# EasyEDA Pro project ProDocument_PCB_2024-08-10_Lastest.epro

# Board PCB1
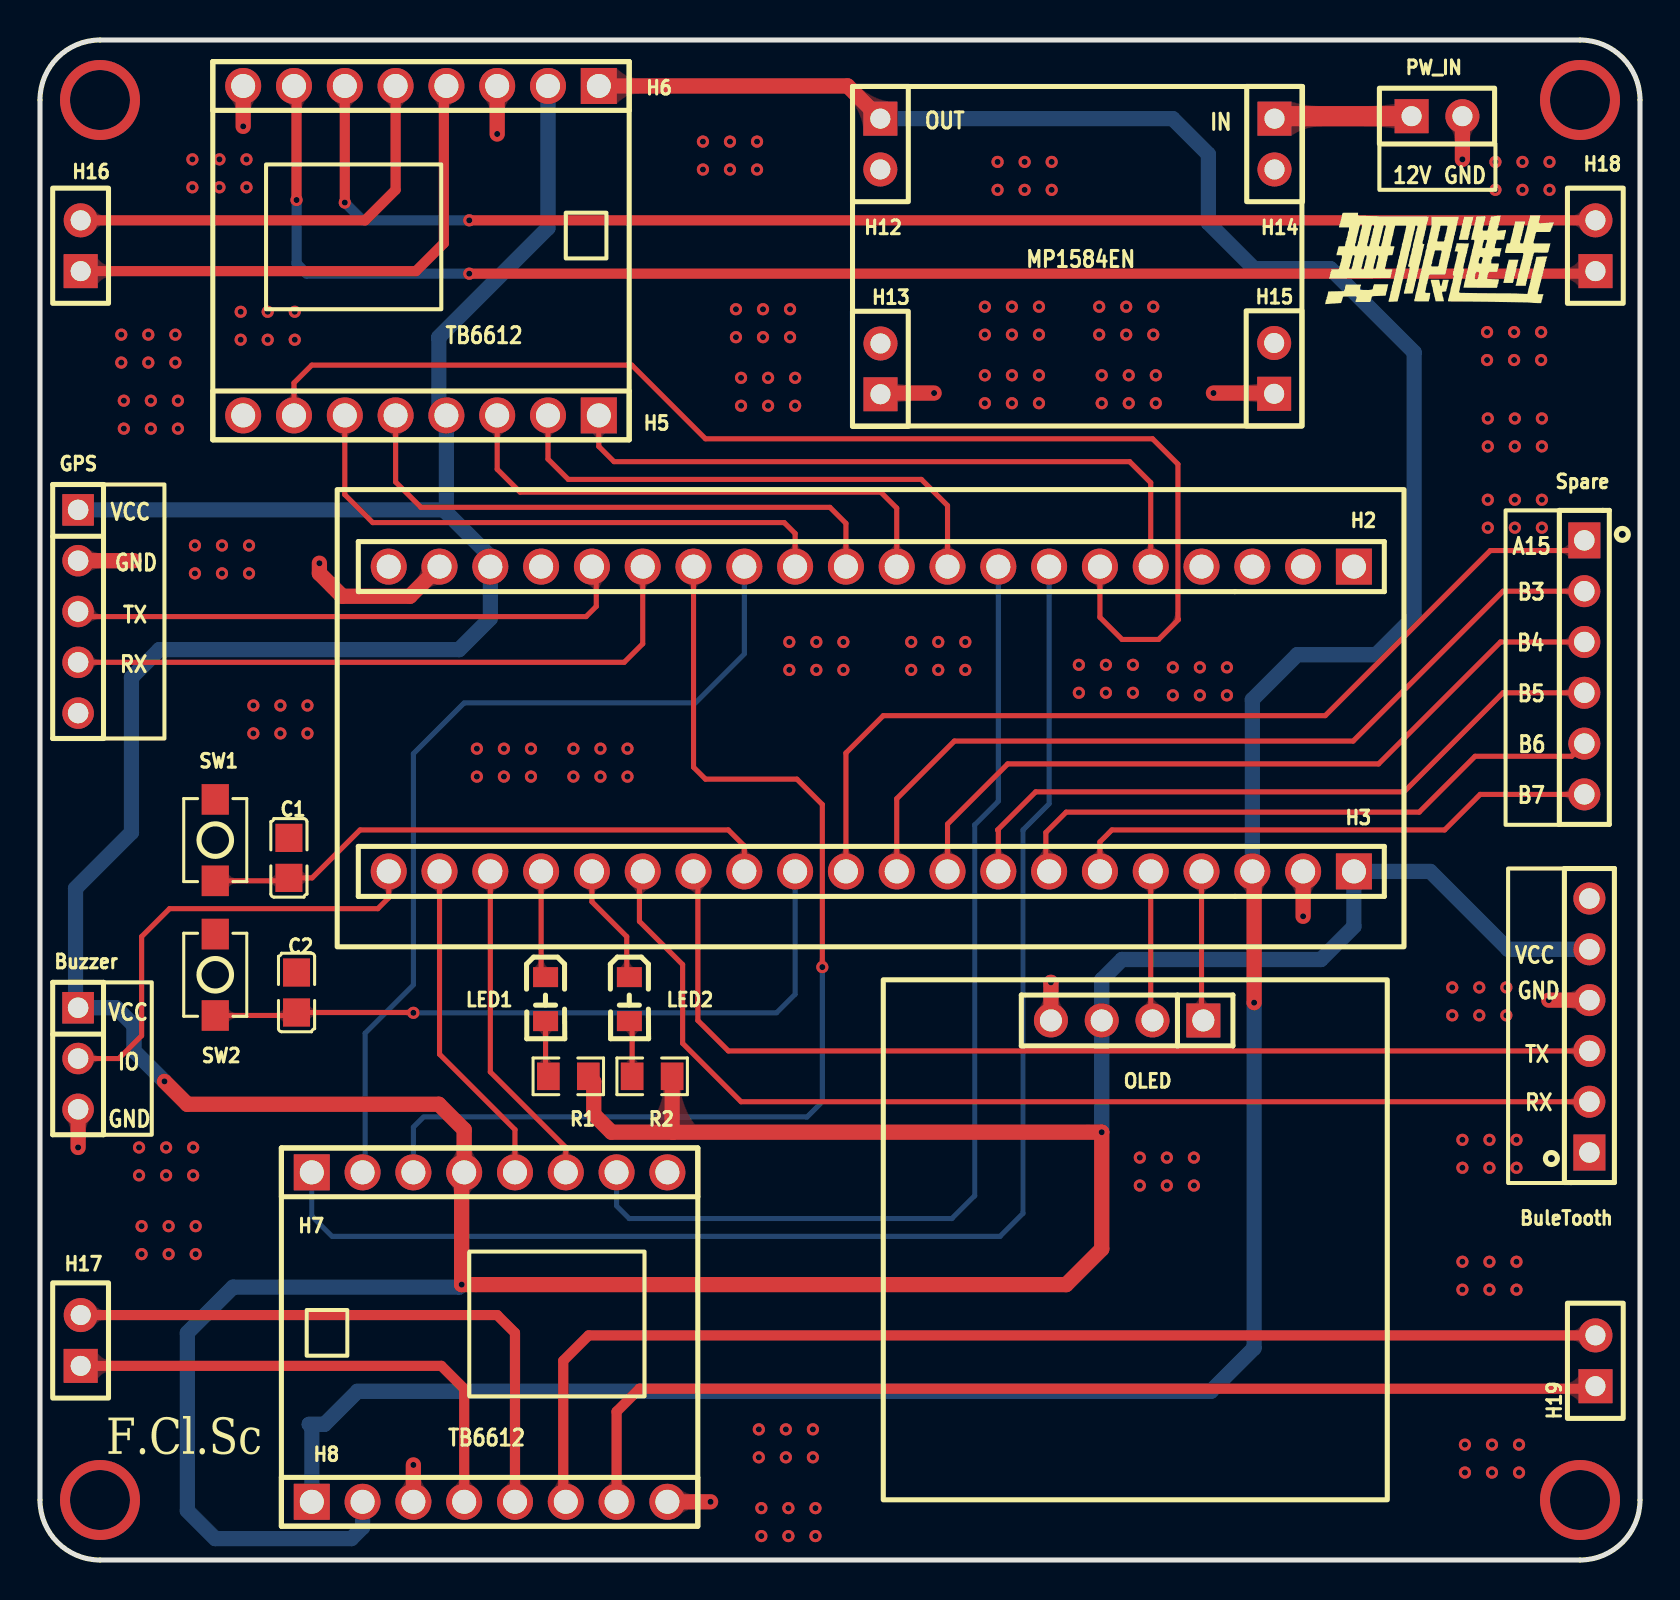
[diagram p0: board, top side]
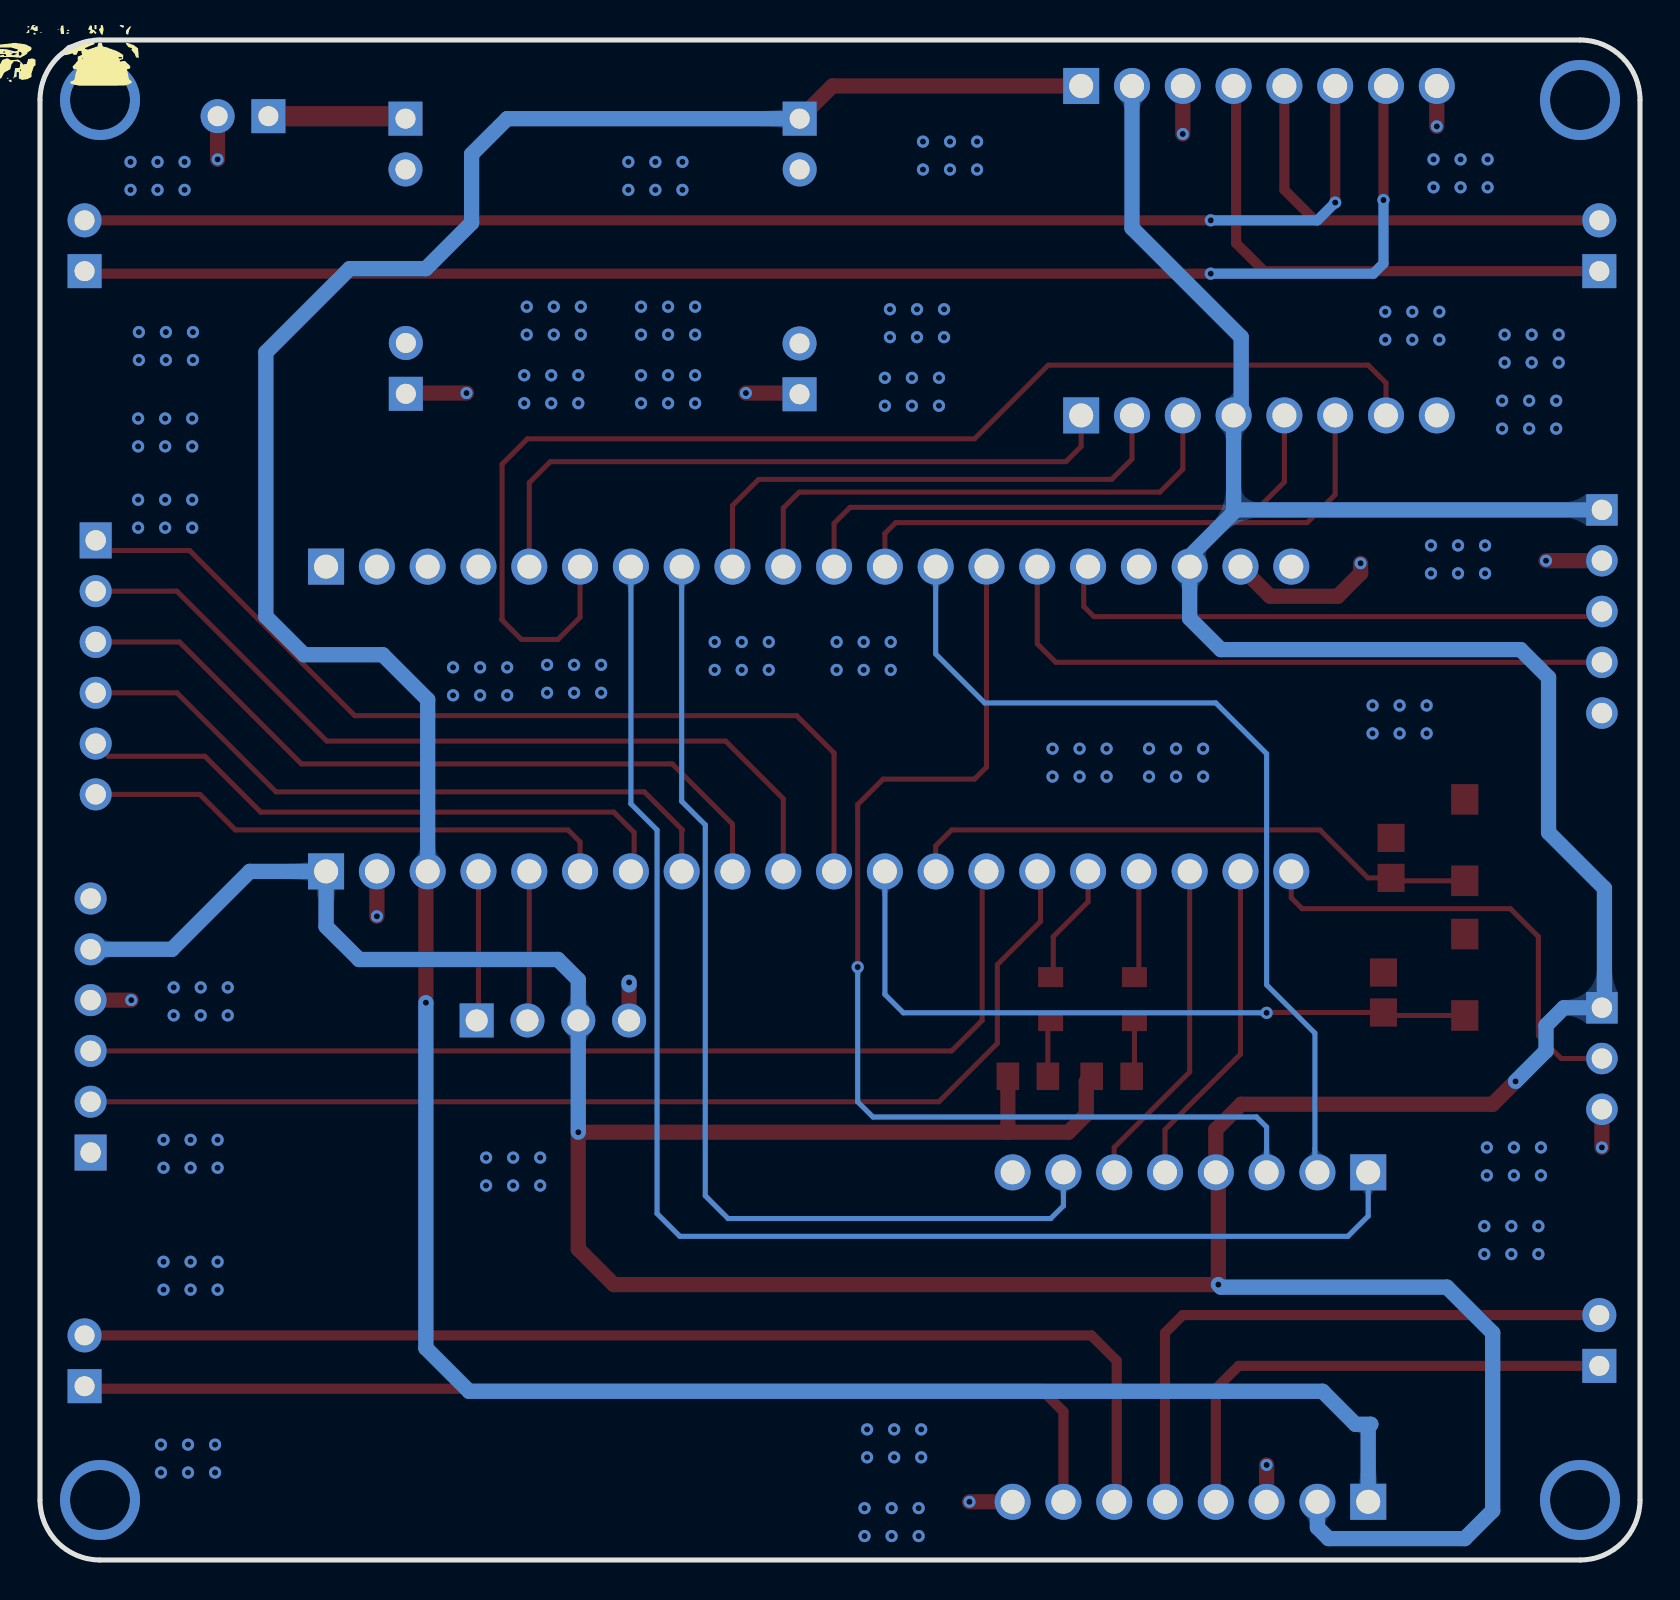
[diagram p1: board, bottom side, seen from below]

Outline 80 x 76 mm; copper layers: Top Layer, Bottom Layer. Coordinates in mm from the lower left corner of the outline.
Outline path: 0,73 0,3 arc(0.88,0.88) 3,0 77,0 arc(79.12,0.88) 80,3 80,73 arc(79.12,75.12) 77,76 3,76 arc(0.88,75.12) 0,73
Stack: Top Layer 0.035mm / Dielectric1 1.51mm FR4 er 4.5 / Bottom Layer 0.035mm

## Design rules (mm)
template: JLCPCB Capability(Two Layers Board)
spacing copperThickness1oz (default): track to track 0.102, other pairs 0.152 to 0.3
spacing copperThickness2oz: track to track 0.203, other pairs 0.152 to 0.3
track width copperThickness1oz (default): min 0.127, default 0.254, max 2.54
track width copperThickness2oz: min 0.203, default 0.254, max 2.54
differential pair differentialPair (default): width min 0.127, default 0.254, max 2.54; gap min 0.152, default 0.152
via viaSize (default): diameter min 0.5, default 0.61, max 10; hole min 0.3, default 0.305, max 6.3

## Placement (name value [footprint] x y rotation side)
BuleTooth  -  [HDR-TH_6P-P2.54-V-F]  77.47 26.72 90 top
Buzzer  -  [HDR-TH_3P-P2.54-V-F]  1.91 25.07 270 top
C1  10uF  [C0805]  12.45 35.11 90 top
C2  10uF  [C0805]  12.83 28.38 90 top
GPS  -  [HDR-TH_5P-P2.54-V-F]  1.91 47.42 270 top
H2  -  [HDR-TH_20P-P2.54-V-F]  41.57 49.67 180 top
H3  -  [HDR-TH_20P-P2.54-V-F]  41.57 34.43 180 top
H5  -  [HDR-TH_8P-P2.54-V-F-1]  19.05 57.23 180 top
H6  -  [HDR-TH_8P-P2.54-V-F-1]  19.05 73.7 180 top
H7  -  [HDR-TH_8P-P2.54-V-F-1]  22.48 19.38 0 top
H8  -  [HDR-TH_8P-P2.54-V-F-1]  22.48 2.91 0 top
H12  -  [HDR-TH_2P-P2.54-V-F]  42.02 70.8 270 top
H13  -  [HDR-TH_2P-P2.54-V-F]  42.02 59.56 90 top
H14  -  [HDR-TH_2P-P2.54-V-F]  61.73 70.8 270 top
H15  -  [HDR-TH_2P-P2.54-V-F]  61.71 59.58 90 top
H16  -  [HDR-TH_2P-P2.54-V-F]  2.03 65.71 90 top
H17  -  [HDR-TH_2P-P2.54-V-F]  2.03 10.98 90 top
H18  -  [HDR-TH_2P-P2.54-V-F]  77.77 65.71 90 top
H19  -  [HDR-TH_2P-P2.54-V-F]  77.77 9.96 90 top
LED1  -  [LED_0805]  25.27 27.99 270 top
LED2  -  [LED_0805]  29.46 27.99 270 top
OLED  -  [HDR-TH_4P-P2.54-V-F]  54.36 26.98 180 top
PW_IN  -  [HDR-TH_2P-P2.54-V-F]  69.85 72.19 0 top
R1  1K  [R0805]  26.42 24.18 180 top
R2  1K  [R0805]  30.61 24.18 180 top
Spare  -  [HDR-TH_6P-P2.54-V-F]  77.22 44.63 270 top
SW1  轻触按键3*4*H  [SW-SMD_L4.0-W2.9-LS5.0]  8.76 36 90 top
SW2  轻触按键3*4*H  [SW-SMD_L4.0-W2.9-LS5.0]  8.76 29.26 90 top

## Footprints (pads in the part's own frame, mm; a bottom-side part is the same pattern mirrored in y, then rotated)
C0805
  rect 1.41x1.35 smd: 1(-1,0) 2(1,0)
HDR-TH_2P-P2.54-V-F
  rect 1.7x1.7 hole 1: 1(-1.27,0)
  round 1.7 hole 1: 2(1.27,0)
HDR-TH_3P-P2.54-V-F
  rect 1.575x1.575 hole 1.02: 1(-2.54,0)
  round 1.575 hole 1.02: 2(0,0) 3(2.54,0)
HDR-TH_4P-P2.54-V-F
  rect 1.7x1.7 hole 1.1: 1(-3.81,0)
  round 1.7 hole 1.1: 2(-1.27,0) 3(1.27,0) 4(3.81,0)
HDR-TH_5P-P2.54-V-F
  rect 1.575x1.575 hole 1.02: 1(-5.08,0)
  round 1.575 hole 1.02: 2(-2.54,0) 3(0,0) 4(2.54,0) 5(5.08,0)
HDR-TH_6P-P2.54-V-F
  rect 1.8x1.6 hole 1.02: 1(-6.35,0)
  round 1.6 hole 1.02: 2(-3.81,0) 3(-1.27,0) 4(1.27,0) 5(3.81,0) 6(6.35,0)
HDR-TH_8P-P2.54-V-F-1
  rect 1.8x1.8 hole 1.2: 1(-8.89,0)
  round 1.8 hole 1.2: 2(-6.35,0) 3(-3.81,0) 4(-1.27,0) 5(1.27,0) 6(3.81,0) 7(6.35,0) 8(8.89,0)
HDR-TH_20P-P2.54-V-F
  rect 1.8x1.8 hole 1.2: 1(-24.13,0)
  round 1.8 hole 1.2: 2(-21.59,0) 3(-19.05,0) 4(-16.51,0) 5(-13.97,0) 6(-11.43,0) 7(-8.89,0) 8(-6.35,0) 9(-3.81,0) 10(-1.27,0) 11(1.27,0) 12(3.81,0) 13(6.35,0) 14(8.89,0) 15(11.43,0) 16(13.97,0) 17(16.51,0) 18(19.05,0) 19(21.59,0) 20(24.13,0)
LED_0805
  rect 1x1.25 smd: 1(-1.15,0.005) 2(1.05,0.005)
R0805
  rect 1.133x1.377 smd: 1(-1,0) 2(1,0)
SW-SMD_L4.0-W2.9-LS5.0
  rect 1.53x1.36 smd: 1(-2.035,0) 2(2.035,0)

## Nets
5V: H3.3 H6.1 H8.1 H12.1
12V: H14.1 PW_IN.1
GND: BuleTooth.4 Buzzer.3 C1.2 C2.2 GPS.2 H2.19 H3.2 H6.3 H6.8 H8.3 H8.8 H13.1 H15.1 OLED.4 PW_IN.2 SW1.2 SW2.2
VCC3V3: BuleTooth.5 Buzzer.1 GPS.1 H2.18 H3.1 H5.4 H6.2 H7.4 H8.2 OLED.3 R1.1 R2.1
A0: H2.5 H5.1
A1: H2.6 H5.7
A2: H2.7 H7.1
A3: H2.8 H7.7
A4: H2.9 H5.2
A5: H2.10 H5.3
A6: H2.11 H5.5
A7: H2.12 H5.6
A8: H3.16 LED2.1
A9: BuleTooth.2 H3.15
A10: BuleTooth.3 H3.14
A11: C1.1 H3.13 SW1.1
A12: C2.1 H3.12 SW2.1
A15: H3.11 Spare.1
AO1: H6.4 H16.1
AO2: H6.5 H16.2
B0: H2.13 H7.2
B1: H2.14 H7.3
B3: H3.10 Spare.2
B4: H3.9 Spare.3
B5: H3.8 Spare.4
B6: H3.7 Spare.5
B7: H3.6 Spare.6
B8: H3.5 OLED.2
B9: H3.4 OLED.1
B10: GPS.4 H2.15
B11: GPS.3 H2.16
B12: Buzzer.2 H3.20
B13: H3.19 H7.5
B14: H3.18 H7.6
B15: H3.17 LED1.1
BO1: H6.7 H18.1
BO2: H6.6 H18.2
CO1: H8.4 H17.1
CO2: H8.5 H17.2
DO1: H8.7 H19.1
DO2: H8.6 H19.2
$1N3515: LED1.2 R1.2
$1N3695: LED2.2 R2.2

Pads without a net: BuleTooth 1 6; GPS 5; H2 1 2 3 4 17 20; H5 8; H7 8; H12 2; H13 2; H14 2; H15 2

## Via types
v1: diameter 4, hole 3, Top Layer to Bottom Layer, 4 vias
v2: diameter 0.61, hole 0.305, Top Layer to Bottom Layer, 221 vias

## Routing (per net, layer and track width the routed paths; a pad name or vN(x,y) marks a point on that pad's centre or on a via; arc(x,y) is an arc through that point)
5V: length 156.5
  Top Layer w0.762: H3.3 60.71,34.34 v2(60.71,27.87) ; H6.1 40.38,73.7 H12.1
  Bottom Layer w0.762: H12.1 56.64,72.07 58.42,70.28 58.42,66.86 60.71,64.57 64.52,64.57 68.71,60.38 68.71,47.17 66.8,45.27 62.87,45.27 60.62,43.02 H3.3 ; v2(60.71,27.87) 60.71,10.59 58.55,8.44 15.88,8.44 14.22,6.78 13.46,6.78 13.59,6.66 13.59,2.91
12V: length 6.9
  Top Layer w1.016: PW_IN.1 61.85,72.19 H14.1
GND: length 34.9
  Top Layer w0.762: H6.3 v2(22.86,71.3) ; v2(44.7,58.35) 42.08,58.35 H13.1 ; H6.8 v2(10.16,71.68) ; BuleTooth.4 v2(75.44,27.99) ; 31.37,2.91 v2(33.53,2.91) ; H3.2 v2(63.16,32.19) ; v2(13.97,49.84) 13.97,49.33 15.11,48.19 18.49,48.19 H2.19 ; H8.3 v2(18.67,4.75) ; PW_IN.2 v2(71.12,70.03) ; OLED.4 v2(50.55,28.88) ; v2(58.67,58.35) 61.67,58.35 H15.1 ; Buzzer.3 v2(1.91,20.63) ; GPS.2 v2(4.7,49.97)
  Bottom Layer w0.762: v2(50.55,28.88) 50.55,28.76
  vias: v2(4.06,61.27) v2(4.06,59.87) v2(4.19,57.97) v2(4.19,56.57) v2(4.95,20.63) v2(4.95,19.23) v2(5.08,16.69) v2(5.08,15.29) v2(5.42,61.27) v2(5.42,59.87) v2(5.54,57.97) v2(5.54,56.57) v2(6.31,20.63) v2(6.31,19.23) v2(6.43,16.69) v2(6.43,15.29) v2(6.77,61.27) v2(6.77,59.87) v2(6.9,57.97) v2(6.9,56.57) v2(7.62,70.03) v2(7.62,68.63) v2(7.75,50.73) v2(7.75,49.33) v2(7.66,20.63) v2(7.66,19.23) v2(7.78,16.69) v2(7.78,15.29) v2(8.97,70.03) v2(8.97,68.63) v2(9.1,50.73) v2(9.1,49.33) v2(10.03,62.41) v2(10.03,61.01) v2(10.32,70.03) v2(10.32,68.63) v2(10.45,50.73) v2(10.45,49.33) v2(10.67,42.73) v2(10.67,41.33) v2(11.39,62.41) v2(11.39,61.01) v2(12.02,42.73) v2(12.02,41.33) v2(12.74,62.41) v2(12.74,61.01) v2(13.37,42.73) v2(13.37,41.33) v2(21.84,40.57) v2(21.84,39.17) v2(23.2,40.57) v2(23.2,39.17) v2(24.55,40.57) v2(24.55,39.17) v2(26.67,40.57) v2(26.67,39.17) v2(28.02,40.57) v2(28.02,39.17) v2(29.37,40.57) v2(29.37,39.17) v2(33.15,70.92) v2(33.15,69.52) v2(34.5,70.92) v2(34.5,69.52) v2(34.8,62.54) v2(34.8,61.14) v2(35.05,59.11) v2(35.05,57.71) v2(35.85,70.92) v2(35.85,69.52) v2(35.94,6.53) v2(35.94,5.13) v2(36.07,2.59) v2(36.07,1.2) v2(36.15,62.54) v2(36.15,61.14) v2(36.4,59.11) v2(36.4,57.71) v2(37.29,6.53) v2(37.29,5.13) v2(37.42,2.59) v2(37.42,1.2) v2(37.5,62.54) v2(37.5,61.14) v2(37.47,45.9) v2(37.47,44.5) v2(37.76,59.11) v2(37.76,57.71) v2(38.65,6.53) v2(38.65,5.13) v2(38.82,45.9) v2(38.82,44.5) v2(38.77,2.59) v2(38.77,1.2) v2(40.17,45.9) v2(40.17,44.5) v2(43.56,45.9) v2(43.56,44.5) v2(44.91,45.9) v2(44.91,44.5) v2(46.27,45.9) v2(46.27,44.5) v2(47.24,62.67) v2(47.24,61.27) v2(47.24,59.24) v2(47.24,57.84) v2(47.88,69.9) v2(47.88,68.51) v2(48.6,62.67) v2(48.6,61.27) v2(48.6,59.24) v2(48.6,57.84) v2(49.23,69.9) v2(49.23,68.51) v2(49.95,62.67) v2(49.95,61.27) v2(49.95,59.24) v2(49.95,57.84) v2(50.58,69.9) v2(50.58,68.51) v2(51.94,44.76) v2(51.94,43.36) v2(52.96,62.67) v2(52.96,61.27) v2(53.09,59.24) v2(53.09,57.84) v2(53.29,44.76) v2(53.29,43.36) v2(54.31,62.67) v2(54.31,61.27) v2(54.44,59.24) v2(54.44,57.84) v2(54.65,44.76) v2(54.65,43.36) v2(54.99,20.12) v2(54.99,18.72) v2(55.66,62.67) v2(55.66,61.27) v2(55.79,59.24) v2(55.79,57.84) v2(56.34,20.12) v2(56.34,18.72) v2(56.64,44.63) v2(56.64,43.23) v2(57.7,20.12) v2(57.7,18.72) v2(57.99,44.63) v2(57.99,43.23) v2(59.35,44.63) v2(59.35,43.23) v2(70.61,28.63) v2(70.61,27.23) v2(71.12,21.01) v2(71.12,19.61) v2(71.12,14.91) v2(71.12,13.52) v2(71.25,5.77) v2(71.25,4.37) v2(71.96,28.63) v2(71.96,27.23) v2(72.35,61.39) v2(72.35,60) v2(72.39,57.08) v2(72.39,55.68) v2(72.39,53.01) v2(72.39,51.62) v2(72.47,21.01) v2(72.47,19.61) v2(72.47,14.91) v2(72.47,13.52) v2(72.6,5.77) v2(72.6,4.37) v2(72.77,69.9) v2(72.77,68.51) v2(73.32,28.63) v2(73.32,27.23) v2(73.71,61.39) v2(73.71,60) v2(73.74,57.08) v2(73.74,55.68) v2(73.74,53.01) v2(73.74,51.62) v2(73.82,21.01) v2(73.82,19.61) v2(73.82,14.91) v2(73.82,13.52) v2(73.95,5.77) v2(73.95,4.37) v2(74.12,69.9) v2(74.12,68.51) v2(75.06,61.39) v2(75.06,60) v2(75.09,57.08) v2(75.09,55.68) v2(75.09,53.01) v2(75.09,51.62) v2(75.48,69.9) v2(75.48,68.51)
VCC3V3: length 256.8
  Top Layer w0.762: v2(6.22,23.93) 7.37,22.79 19.94,22.79 21.21,21.52 H7.4 21.08,19.26 v2(21.08,13.77) 51.31,13.77 53.09,15.55 v2(53.09,21.39) 31.65,21.39 ; 31.65,21.39 28.57,21.39 27.69,22.28 27.69,23.91 R1.1 ; 31.65,21.39 31.61,21.43 R2.1
  Bottom Layer w0.762: BuleTooth.5 73.41,30.53 69.51,34.43 H3.1 65.7,31.68 64.04,30.03 54.1,30.03 53.09,29.01 OLED.3 v2(53.09,21.39) ; 20.19,52.5 22.52,50.18 H2.18 22.52,47.08 20.96,45.52 5.97,45.52 4.57,44.12 4.57,36.38 1.78,33.58 1.78,27.74 Buzzer.1 3.81,27.61 4.7,26.72 4.7,25.45 v2(6.22,23.93) ; 20.19,52.5 GPS.1 ; 20.19,52.5 20.32,52.5 H5.4 19.94,57.61 19.94,61.14 25.4,66.6 H6.2 ; 16.13,2.91 16.13,1.63 15.57,1.07 8.76,1.07 7.37,2.47 7.37,11.36 9.65,13.64 20.96,13.64 v2(21.08,13.77)
(no net):
  vias: v1(3,73) v1(3,3) v1(77,73) v1(77,3)
A0: length 34.1
  Top Layer w0.254: H2.5 55.54,53.86 54.48,54.92 28.7,54.92 27.94,55.68 H5.1
A1: length 63.4
  Top Layer w0.254: H5.7 12.7,58.86 13.59,59.74 29.59,59.74 33.27,56.06 55.63,56.06 56.9,54.79 56.9,47.04 56.92,47.02 55.93,46.03 54.1,46.03 53,47.13 H2.6
A2: length 71.5
  Bottom Layer w0.254: 13.59,19.38 13.59,17.2 14.61,16.18 48.01,16.18 49.15,17.33 49.15,36.5 50.46,37.81 H2.7
A3: length 52.3
  Bottom Layer w0.254: H7.7 28.83,17.71 29.46,17.07 45.59,17.07 46.74,18.22 46.74,36.76 47.92,37.94 H2.8
A4: length 26.2
  Top Layer w0.254: H2.9 45.38,52.72 44.07,54.03 26.42,54.03 25.4,55.05 H5.2
A5: length 26.4
  Top Layer w0.254: H5.3 22.86,54.54 24,53.39 42.04,53.39 42.84,52.59 H2.10
A6: length 28.9
  Top Layer w0.254: H2.11 40.3,51.83 39.5,52.63 19.05,52.63 17.78,53.9 H5.5
A7: length 28.9
  Top Layer w0.254: H2.12 37.76,51.33 37.21,51.87 16.64,51.87 15.24,53.27 H5.6
A8: length 6.1
  Top Layer w0.254: LED2.1 29.34,29.28 29.34,31.17 27.6,32.91 H3.16
A9: length 56.1
  Top Layer w0.254: BuleTooth.2 35.05,22.91 32.13,25.83 32.13,29.77 29.97,31.93 29.97,34.27 H3.15
A10: length 52.7
  Top Layer w0.254: BuleTooth.3 34.42,25.45 32.89,26.98 32.89,34.21 H3.14
A11: length 29.1
  Top Layer w0.254: SW1.1 12.3,33.96 C1.1 13.61,34.11 16,36.5 34.42,36.5 35.22,35.7 H3.13
A12: length 35.6
  Top Layer w0.254: SW2.1 12.68,27.23 C2.1 18.65,27.38 v2(18.67,27.36)
  Bottom Layer w0.254: v2(18.67,27.36) 36.83,27.36 37.76,28.28 H3.12
A15: length 47.2
  Top Layer w0.254: H3.11 40.3,40.35 42.16,42.22 64.26,42.22 72.52,50.47 76.71,50.47 Spare.1
AO1: length 26.7
  Top Layer w0.508: H16.1 18.8,64.44 20.19,65.84 20.19,73.57 H6.4
AO2: length 21.6
  Top Layer w0.508: H6.5 17.78,68.51 16.26,66.98 2.03,66.98
B0: length 45
  Bottom Layer w0.254: 16.13,19.38 16.26,19.51 16.26,26.34 18.67,28.76 18.67,40.31 21.21,42.85 32.77,42.85 35.22,45.3 H2.13
B1: length 55.3
  Top Layer w0.254: H2.14 32.68,39.64 33.27,39.04 37.85,39.04 39.12,37.77 v2(39.12,29.64)
  Bottom Layer w0.254: v2(39.12,29.64) 39.12,22.91 38.35,22.15 19.18,22.15 18.67,21.64 H7.3
B3: length 42.3
  Top Layer w0.254: H3.10 42.84,38.06 45.72,40.95 65.66,40.95 73.15,48.44 Spare.2
B4: length 38
  Top Layer w0.254: H3.9 45.38,36.79 48.39,39.81 66.93,39.81 73.03,45.9 Spare.3
B5: length 34.3
  Top Layer w0.254: H3.8 47.92,36.47 47.88,36.5 49.78,38.41 68.2,38.41 73.15,43.36 Spare.4
B6: length 30.8
  Top Layer w0.254: H3.7 50.29,34.59 50.29,36.38 51.31,37.39 68.96,37.39 71.75,40.19 76.58,40.19 Spare.5
B7: length 26.7
  Top Layer w0.254: H3.6 53,35.91 53.59,36.5 70.23,36.5 72.01,38.28 Spare.6
B8: length 7.5
  Top Layer w0.254: H3.5 55.54,27.07 OLED.2
B9: length 7.5
  Top Layer w0.254: OLED.1 58.08,27.07 H3.4
B10: length 32.9
  Top Layer w0.254: 1.52,44.89 29.21,44.89 30.14,45.81 H2.15
B11: length 28.5
  Top Layer w0.254: 1.91,47.81 2.54,47.17 27.31,47.17 27.81,47.68 27.81,49.45 H2.16
B12: length 23.1
  Top Layer w0.254: Buzzer.2 3.94,25.07 5.08,26.22 5.08,31.17 6.48,32.57 16.89,32.57 17.44,33.11 H3.20
B13: length 16.6
  Top Layer w0.254: 23.75,19.38 23.75,21.52 19.98,25.29 H3.19
B14: length 16.6
  Top Layer w0.254: 26.29,19.38 26.29,20.63 22.52,24.4 H3.18
B15: length 5.4
  Top Layer w0.254: H3.17 25.06,29.37 LED1.1
BO1: length 74.1
  Top Layer w0.508: H18.1 77.65,64.32 v2(21.46,64.32) ; H6.7 12.83,73.57 v2(12.83,68)
  Bottom Layer w0.508: v2(21.46,64.32) 13.33,64.32 12.83,64.82 v2(12.83,68)
BO2: length 68.7
  Top Layer w0.508: v2(15.24,67.87) H6.6 ; v2(21.46,66.98) 77.77,66.98
  Bottom Layer w0.508: v2(15.24,67.87) 16.13,66.98 v2(21.46,66.98)
CO1: length 25.3
  Top Layer w0.508: H8.4 21.21,8.56 20.07,9.71 H17.1
CO2: length 30.5
  Top Layer w0.508: H17.2 22.86,12.25 23.75,11.36 23.75,2.91
DO1: length 54
  Top Layer w0.508: H8.7 28.83,7.42 29.97,8.56 77.65,8.56 H19.1
DO2: length 59.2
  Top Layer w0.508: H19.2 27.43,11.23 26.16,9.96 26.16,3.04 26.29,2.91
$1N3515: length 2.8
  Top Layer w0.254: LED1.2 25.28,24.32 R1.2
$1N3695: length 2.8
  Top Layer w0.254: R2.2 29.61,26.81 LED2.2

## Copper pours and planes (outline as drawn; the poured copper is in the pictures)
GND on Top Layer: -4.95,77.4 84.33,77.4 84.33,-6.17 -4.95,-6.17
GND on Bottom Layer: -9.14,81.08 87.63,81.08 87.63,-7.95 -9.14,-7.95

Small or netless copper shapes (teardrops, artwork), in the pictures only: 117 on Top Layer, 36 on Bottom Layer

## Text on the board
Top Silkscreen Layer: A15 | VCC | B4 | GND | B3 | B5 | B7 | B6 | TX | RX | TB6612 | MP1584EN | IO | OUT | IN | 12V | F.Cl.Sc
